# Altium project ws22_companion-1_0_0.PrjPcb (part 2 of 4)

## Sheet pmic_tps65263_buck.SchDoc
size A; SheetNumber: 7
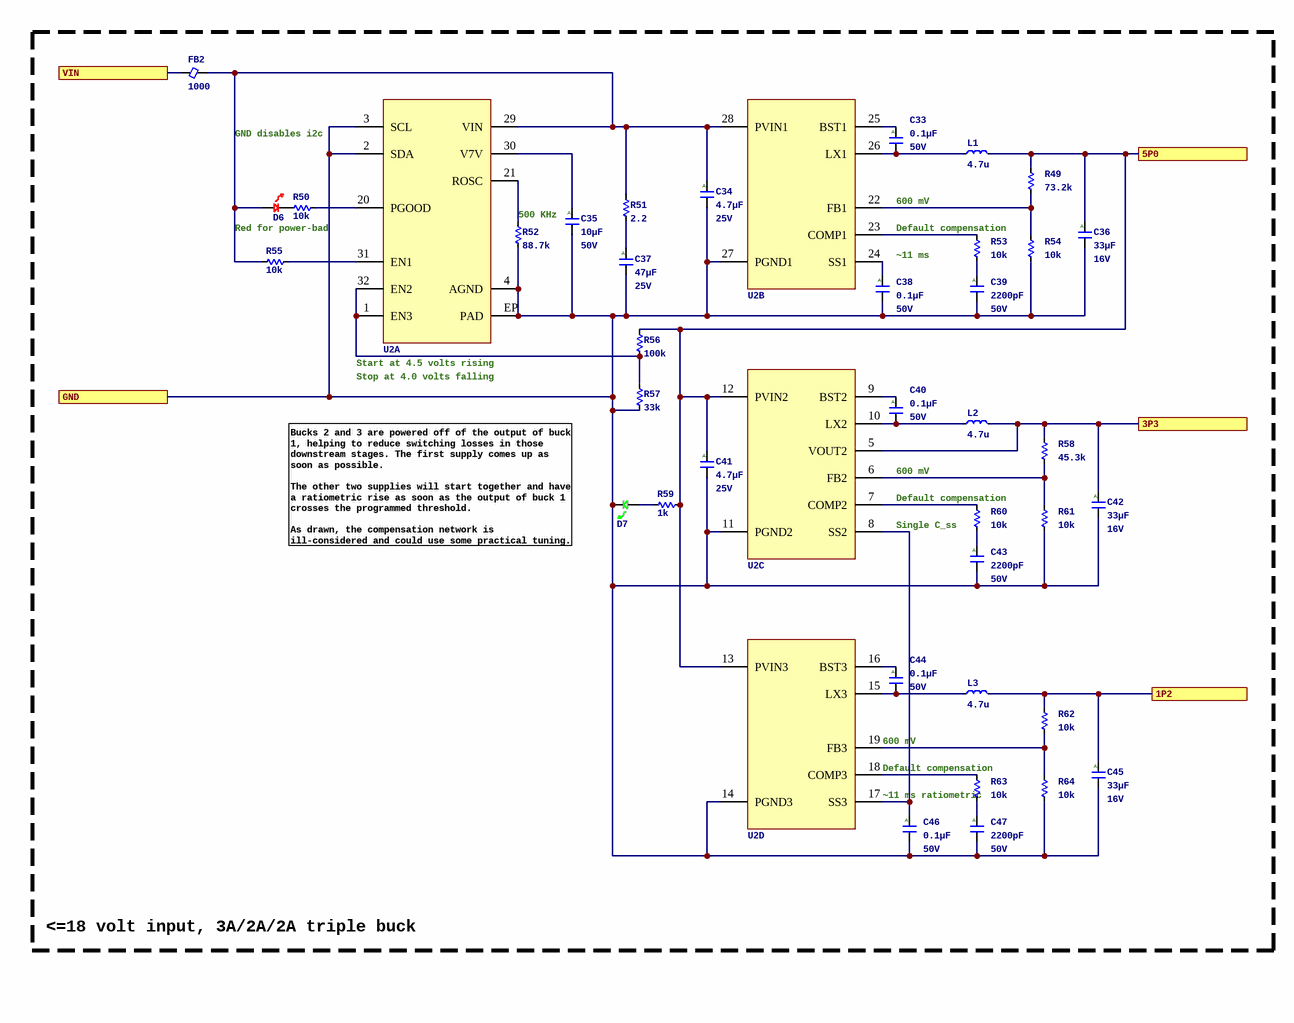
[diagram p6: pmic_tps65263_buck.SchDoc]

### Parts
C33  Capacitance: 0.1µF  Voltage - Rated: 50V  [C0402_0.55MM]  (hidden comment: CGA2B3X7R1H104M050BB)
C34  Capacitance: 4.7µF  Voltage - Rated: 25V  [C0805_1.45MM]  (hidden comment: CGA4J1X7R1E475K125AC)
C35  Capacitance: 10µF  Voltage - Rated: 50V  [C1206_1.90MM]  (hidden comment: CGA5L1X7R1H106K160AC)
C36  Capacitance: 33µF  Voltage - Rated: 16V  [C1812_2.50MM]  (hidden comment: CGA8P1X7R1C336M250KC)
C37  Capacitance: 47µF  Voltage - Rated: 25V  [C2220_2.50MM]  (hidden comment: CGA9N3X7R1E476M230KB)
C38  Capacitance: 0.1µF  Voltage - Rated: 50V  [C0402_0.55MM]  (hidden comment: CGA2B3X7R1H104M050BB)
C39  Capacitance: 2200pF  Voltage - Rated: 50V  [C0402_0.55MM]  (hidden comment: CGA2B2X7R1H222M050BA)
C40  Capacitance: 0.1µF  Voltage - Rated: 50V  [C0402_0.55MM]  (hidden comment: CGA2B3X7R1H104M050BB)
C41  Capacitance: 4.7µF  Voltage - Rated: 25V  [C0805_1.45MM]  (hidden comment: CGA4J1X7R1E475K125AC)
C42  Capacitance: 33µF  Voltage - Rated: 16V  [C1812_2.50MM]  (hidden comment: CGA8P1X7R1C336M250KC)
C43  Capacitance: 2200pF  Voltage - Rated: 50V  [C0402_0.55MM]  (hidden comment: CGA2B2X7R1H222M050BA)
C44  Capacitance: 0.1µF  Voltage - Rated: 50V  [C0402_0.55MM]  (hidden comment: CGA2B3X7R1H104M050BB)
C45  Capacitance: 33µF  Voltage - Rated: 16V  [C1812_2.50MM]  (hidden comment: CGA8P1X7R1C336M250KC)
C46  Capacitance: 0.1µF  Voltage - Rated: 50V  [C0402_0.55MM]  (hidden comment: CGA2B3X7R1H104M050BB)
C47  Capacitance: 2200pF  Voltage - Rated: 50V  [C0402_0.55MM]  (hidden comment: CGA2B2X7R1H222M050BA)
D6  LTST-C190KRKT  [LED_0603P_RED]  (value not drawn)
D7  LTST-C190GKT  [LED_0603P_GREEN]  (value not drawn)
FB2  Impedance (Ohms @ 100MHz): 1000  [FB0805_1.05MM]  (hidden comment: MPZ2012S102AT000)
L1  Inductance: 4.7u  [WE-MAPI_4030]  (hidden comment: 74438357047)
L2  Inductance: 4.7u  [WE-MAPI_4030]  (hidden comment: 74438357047)
L3  Inductance: 4.7u  [WE-MAPI_4030]  (hidden comment: 74438357047)
R49  Resistance: 73.2k  [R0402_0.40MM]  (hidden comment: ERJ-2RKF7322X)
R50  Resistance: 10k  [R0402_0.40MM]  (hidden comment: ERJ-2RKF1002X)
R51  Resistance: 2.2  [R0805_0.70MM]  (hidden comment: ERJ-6DQF2R2V)
R52  Resistance: 88.7k  [R0402_0.40MM]  (hidden comment: ERJ-2RKF8872X)
R53  Resistance: 10k  [R0402_0.40MM]  (hidden comment: ERJ-2RKF1002X)
R54  Resistance: 10k  [R0402_0.40MM]  (hidden comment: ERJ-2RKF1002X)
R55  Resistance: 10k  [R0402_0.40MM]  (hidden comment: ERJ-2RKF1002X)
R56  Resistance: 100k  [R0402_0.40MM]  (hidden comment: ERJ-2RKF1003X)
R57  Resistance: 33k  [R0402_0.40MM]  (hidden comment: ERJ-2RKF3302X)
R58  Resistance: 45.3k  [R0402_0.40MM]  (hidden comment: ERJ-2RKF4532X)
R59  Resistance: 1k  [R0402_0.40MM]
R60  Resistance: 10k  [R0402_0.40MM]  (hidden comment: ERJ-2RKF1002X)
R61  Resistance: 10k  [R0402_0.40MM]  (hidden comment: ERJ-2RKF1002X)
R62  Resistance: 10k  [R0402_0.40MM]  (hidden comment: ERJ-2RKF1002X)
R63  Resistance: 10k  [R0402_0.40MM]  (hidden comment: ERJ-2RKF1002X)
R64  Resistance: 10k  [R0402_0.40MM]  (hidden comment: ERJ-2RKF1002X)
U2  TPS65263QRHBRQ1  [TI_RHB]  (value not drawn)  (parts A,B,C,D of 4)

### Ports
1P2, 3P3, 5P0, GND, VIN

### Nets
1P2: C45.1 L3.2 R62.2 ; port 1P2
3P3: C42.1 L2.2 R58.2 U2.5(VOUT2) ; port 3P3
5P0: C36.1 C41.1 L1.2 R49.2 R56.2 R59.1 U2.12(PVIN2) U2.13(PVIN3) ; port 5P0
GND: C34.2 C35.2 C36.2 C37.2 C38.2 C39.2 C41.2 C42.2 C43.2 C45.2 C46.2 C47.2 D7.1 R52.1 R54.1 R57.1 R61.1 R64.1 U2.2(SDA) U2.3(SCL) U2.4(AGND) U2.11(PGND2) U2.14(PGND3) U2.27(PGND1) U2.EP(PAD) ; port GND
LV: FB2.1 ; port VIN
NetC33_1: C33.1 U2.25(BST1)
NetC33_2: C33.2 L1.1 U2.26(LX1)
NetC34_1: C34.1 D6.2 FB2.2 R51.2 R55.1 U2.28(PVIN1) U2.29(VIN)
NetC35_1: C35.1 U2.30(V7V)
NetC37_1: C37.1 R51.1
NetC38_1: C38.1 U2.24(SS1)
NetC39_1: C39.1 R53.1
NetC40_1: C40.1 U2.9(BST2)
NetC40_2: C40.2 L2.1 U2.10(LX2)
NetC43_1: C43.1 R60.1
NetC44_1: C44.1 U2.16(BST3)
NetC44_2: C44.2 L3.1 U2.15(LX3)
NetC46_1: C46.1 U2.8(SS2) U2.17(SS3)
NetC47_1: C47.1 R63.1
NetD6_1: D6.1 R50.2
NetD7_2: D7.2 R59.2
NetR49_1: R49.1 R54.2 U2.22(FB1)
NetR50_1: R50.1 U2.20(PGOOD)
NetR52_2: R52.2 U2.21(ROSC)
NetR53_2: R53.2 U2.23(COMP1)
NetR55_2: R55.2 U2.31(EN1)
NetR56_1: R56.1 R57.2 U2.1(EN3) U2.32(EN2)
NetR58_1: R58.1 R61.2 U2.6(FB2)
NetR60_2: R60.2 U2.7(COMP2)
NetR62_1: R62.1 R64.2 U2.19(FB3)
NetR63_2: R63.2 U2.18(COMP3)

### Notes on the sheet
- GND disables i2c
- Red for power-bad
- (near R52) 500 KHz
- 600 mV
- (near R53) Default compensation
- ~11 ms
- (near U2) Start at 4.5 volts rising
- Stop at 4.0 volts falling
- (near R60) Default compensation
- Bucks 2 and 3 are powered off of the output of buck 1, helping to reduce switching losses in those downstream stages. The first supply comes up as soon as possible.
  The other two supplies will start together and have a ratiometric rise as soon as the output of buck 1 crosses the programmed threshold.
  As drawn, the compensation network is ill-considered and could use some practical tuning.
- Single C_ss
- (near U2) 600 mV
- (near R63) Default compensation
- (near R63) ~11 ms ratiometric
- <=18 volt input, 3A/2A/2A triple buck
- (in symbol CGA2B2X7R1H222M050BA) A
- (in symbol CGA2B3X7R1H104M050BB) A
- (in symbol CGA4J1X7R1E475K125AC) A
- (in symbol CGA5L1X7R1H106K160AC) A
- (in symbol CGA8P1X7R1C336M250KC) A
- (in symbol CGA9N3X7R1E476M230KB) A

### Library data of the parts
C33 C38 C40 C44 C46 = CGA2B3X7R1H104M050BB: as C4 on sheet mcu_stm32f427; ComponentLink1URL: https://product.tdk.com/info/en/catalog/datasheets/mlcc_automotive_general_en.pdf?ref_disty=digikey; ComponentLink1Description: Series Datasheet; Series: CGA; Part Status: Active; Temperature Coefficient: X7R; Operating Temperature: -55°C ~ 125°C; Applications: AEC-Q200; Mounting Type: Surface Mount, MLCC; Package / Case: 0402 (1005 Metric); Size / Dimension: 0.039" L x 0.020" W (1.00mm x 0.50mm); Thickness (Max): 0.022" (0.55mm); Supplier 1: Digikey; Supplier Part Number 1: 445-12271-1-ND; Manufacturer Part Number: CGA2B3X7R1H104M050BB
C34 C41 = CGA4J1X7R1E475K125AC: CAP CER 4.7UF 25V X7R 0805; Manufacturer: TDK Corporation; Unit Price (USD): 0.56; Tolerance: ±10%; ComponentLink1URL: https://product.tdk.com/info/en/catalog/datasheets/mlcc_automotive_general_en.pdf?ref_disty=digikey; ComponentLink1Description: Series Datasheet; Series: CGA; Part Status: Active; Temperature Coefficient: X7R; Operating Temperature: -55°C ~ 125°C; Applications: AEC-Q200; Mounting Type: Surface Mount, MLCC; Package / Case: 0805 (2012 Metric); Size / Dimension: 0.079" L x 0.049" W (2.00mm x 1.25mm); Thickness (Max): 0.057" (1.45mm); Supplier 1: Digikey; Supplier Part Number 1: 445-6967-1-ND; Manufacturer Part Number: CGA4J1X7R1E475K125AC
C35 = CGA5L1X7R1H106K160AC: as C63 on sheet conn_usbc; ComponentLink1URL: https://product.tdk.com/info/en/catalog/datasheets/mlcc_automotive_general_en.pdf?ref_disty=digikey; ComponentLink1Description: Series Datasheet; Series: CGA; Part Status: Active; Temperature Coefficient: X7R; Operating Temperature: -55°C ~ 125°C; Applications: AEC-Q200; Mounting Type: Surface Mount, MLCC; Package / Case: 1206 (3216 Metric); Size / Dimension: 0.126" L x 0.063" W (3.20mm x 1.60mm); Thickness (Max): 0.075" (1.90mm); Supplier 1: Digikey; Supplier Part Number 1: 445-180362-1-ND; Manufacturer Part Number: CGA5L1X7R1H106K160AC
C36 C42 C45 = CGA8P1X7R1C336M250KC: CAP CER 33UF 16V X7R 1812; Manufacturer: TDK Corporation; Unit Price (USD): 1.67; Tolerance: ±20%; ComponentLink1URL: https://product.tdk.com/info/en/catalog/datasheets/mlcc_automotive_general_en.pdf?ref_disty=digikey; ComponentLink1Description: Series Datasheet; Series: CGA; Part Status: Active; Temperature Coefficient: X7R; Operating Temperature: -55°C ~ 125°C; Applications: AEC-Q200; Mounting Type: Surface Mount, MLCC; Package / Case: 1812 (4532 Metric); Size / Dimension: 0.177" L x 0.126" W (4.50mm x 3.20mm); Thickness (Max): 0.098" (2.50mm); Supplier 1: Digikey; Supplier Part Number 1: 445-7912-1-ND; Manufacturer Part Number: CGA8P1X7R1C336M250KC
C37 = CGA9N3X7R1E476M230KB: CAP CER 47UF 25V X7R 2220; Manufacturer: TDK Corporation; Unit Price (USD): 4.53; Tolerance: ±20%; ComponentLink1URL: https://product.tdk.com/info/en/catalog/datasheets/mlcc_automotive_general_en.pdf?ref_disty=digikey; ComponentLink1Description: Series Datasheet; Series: CGA; Part Status: Active; Temperature Coefficient: X7R; Operating Temperature: -55°C ~ 125°C; Applications: AEC-Q200; Mounting Type: Surface Mount, MLCC; Package / Case: 2220 (5750 Metric); Size / Dimension: 0.224" L x 0.197" W (5.70mm x 5.00mm); Thickness (Max): 0.098" (2.50mm); Supplier 1: Digikey; Supplier Part Number 1: 445-174773-1-ND; Manufacturer Part Number: CGA9N3X7R1E476M230KB
C39 C43 C47 = CGA2B2X7R1H222M050BA: CAP CER 2200PF 50V X7R 0402; Manufacturer: TDK Corporation; Unit Price (USD): 0.1; Tolerance: ±20%; ComponentLink1URL: https://product.tdk.com/info/en/catalog/datasheets/mlcc_automotive_general_en.pdf?ref_disty=digikey; ComponentLink1Description: Series Datasheet; Series: CGA; Part Status: Active; Temperature Coefficient: X7R; Operating Temperature: -55°C ~ 125°C; Applications: AEC-Q200; Mounting Type: Surface Mount, MLCC; Package / Case: 0402 (1005 Metric); Size / Dimension: 0.039" L x 0.020" W (1.00mm x 0.50mm); Thickness (Max): 0.022" (0.55mm); Supplier 1: Digikey; Supplier Part Number 1: 445-12274-1-ND; Manufacturer Part Number: CGA2B2X7R1H222M050BA
D6 = LED_0603_RED_LTST-C190KRKT: LED SUPER RED CLEAR 0603 SMD; Manufacturer: Lite-On Inc; ComponentLink1URL: https://optoelectronics.liteon.com/upload/download/DS-22-99-0151/LTST-C190KRKT.pdf; ComponentLink1Description: Datasheet; Supplier 1: Digikey; Supplier Part Number 1: 160-1436-1-ND; Manufacturer Part Number: LTST-C190KRKT; Supplier 2: LCSC; Supplier Part Number 2: C94869
D7 = LED_0603_GREEN_LTST-C190GKT: as D3 on sheet mcu_stm32f427; Supplier 1: Digikey; ComponentLink1URL: https://mm.digikey.com/Volume0/opasdata/d220001/medias/docus/858/LTST-C190GKT.pdf; ComponentLink1Description: Datasheet; Supplier Part Number 1: 160-1183-1-ND; Manufacturer Part Number: LTST-C190GKT; Supplier 2: LCSC; Supplier Part Number 2: C125093
FB2 = MPZ2012S102AT000: FERRITE BEAD 1 KOHM 0805 1LN; Manufacturer: TDK Corporation; Filter Type: Power Line; Current Rating (Max): 1.5A; DC Resistance (DCR) (Max): 150mOhm; ComponentLink1URL: https://product.tdk.com/info/en/catalog/datasheets/beads_commercial_power_mpz2012_en.pdf?ref_disty=digikey; ComponentLink1Description: Datasheet; Series: MPZ; Part Status: Active; Operating Temperature: -55°C ~ 125°C; Package / Case: 0805 (2012 Metric); Mounting Type: Surface Mount; Height (Max): 0.041" (1.05mm); Size / Dimension: 0.079" L x 0.049" W (2.00mm x 1.25mm); Supplier Part Number 1: 445-5223-1-ND; Supplier 1: Digikey; Manufacturer Part Number: MPZ2012S102AT000
L1-L3 = 74438357047: FIXED IND 4.7UH 3.9A 44 MOHM SMD; Manufacturer: Würth Elektronik; Type: Molded; Material - Core: Metal Composite; Tolerance: ±20%; Current - Saturation: 6.4A; Shielding: Shielded; DC Resistance (DCR): 44mOhm Max; Frequency - Self Resonant: 24MHz; Inductance Frequency - Test: 100kHz; ComponentLink1URL: https://katalog.we-online.de/pbs/datasheet/74438357047.pdf; ComponentLink1Description: Datasheet; Supplier 1: Digikey; Supplier Part Number 1: 732-11202-1-ND; Series: WE-MAPI; Part Status: Active; Current Rating (Amps): 3.9A; Q @ Freq: -; Operating Temperature: -40°C ~ 125°C; Mounting Type: Surface Mount; Package / Case: Nonstandard; Supplier Device Package: 4030; Size / Dimension: 0.161" L x 0.161" W (4.10mm x 4.10mm); Height - Seated (Max): 0.122" (3.10mm); Manufacturer Part Number: 74438357047
R49 = ERJ-2RKF7322X: RES SMD 73.2K OHM 1% 1/10W 0402; Manufacturer: Panasonic Electronic Components; Unit Price (USD): 0.1; Power (Watts): 0.1W, 1/10W; Temperature Coefficient: ±100ppm/°C; ComponentLink1Description: Datasheet; ComponentLink1URL: https://industrial.panasonic.com/cdbs/www-data/pdf/RDA0000/AOA0000C304.pdf; Series: ERJ; Tolerance: ±1%; Composition: Thick Film; Features: Automotive AEC-Q200; Operating Temperature: -55°C ~ 155°C; Package / Case: 0402 (1005 Metric); Supplier Device Package: 0402; Size / Dimension: 0.039" L x 0.020" W (1.00mm x 0.50mm); Height - Seated (Max): 0.016" (0.40mm); Supplier 1: Digikey; Supplier Part Number 1: P73.2KLCT-ND; Manufacturer Part Number: ERJ-2RKF7322X
R50 R53-R55 R60-R64 = ERJ-2RKF1002X: RES SMD 10K OHM 1% 1/10W 0402; Manufacturer: Panasonic Electronic Components; Unit Price (USD): 0.1; Power (Watts): 0.1W, 1/10W; Temperature Coefficient: ±100ppm/°C; ComponentLink1Description: Datasheet; ComponentLink1URL: https://industrial.panasonic.com/cdbs/www-data/pdf/RDA0000/AOA0000C304.pdf; Series: ERJ; Tolerance: ±1%; Composition: Thick Film; Features: Automotive AEC-Q200; Operating Temperature: -55°C ~ 155°C; Package / Case: 0402 (1005 Metric); Supplier Device Package: 0402; Size / Dimension: 0.039" L x 0.020" W (1.00mm x 0.50mm); Height - Seated (Max): 0.016" (0.40mm); Supplier 1: Digikey; Supplier Part Number 1: P10.0KLCT-ND; Manufacturer Part Number: ERJ-2RKF1002X
R51 = ERJ-6DQF2R2V: RES SMD 2.2 OHM 1% 1/2W 0805; Manufacturer: Panasonic Electronic Components; Unit Price (USD): 0.36; Power (Watts): 0.5W, 1/2W; Temperature Coefficient: ±100ppm/°C; ComponentLink1Description: Datasheet; ComponentLink1URL: https://industrial.panasonic.com/cdbs/www-data/pdf/RDN0000/AOA0000C313.pdf; Series: ERJ; Tolerance: ±1%; Composition: Thick Film; Features: Automotive AEC-Q200, Current Sense; Operating Temperature: -55°C ~ 155°C; Package / Case: 0805 (2012 Metric); Supplier Device Package: 0805; Size / Dimension: 0.079" L x 0.049" W (2.00mm x 1.25mm); Height - Seated (Max): 0.028" (0.70mm); Supplier 1: Digikey; Supplier Part Number 1: P19276CT-ND; Manufacturer Part Number: ERJ-6DQF2R2V
R52 = ERJ-2RKF8872X: RES SMD 88.7K OHM 1% 1/10W 0402; Manufacturer: Panasonic Electronic Components; Unit Price (USD): 0.1; Power (Watts): 0.1W, 1/10W; Temperature Coefficient: ±100ppm/°C; ComponentLink1Description: Datasheet; ComponentLink1URL: https://industrial.panasonic.com/cdbs/www-data/pdf/RDA0000/AOA0000C304.pdf; Series: ERJ; Tolerance: ±1%; Composition: Thick Film; Features: Automotive AEC-Q200; Operating Temperature: -55°C ~ 155°C; Package / Case: 0402 (1005 Metric); Supplier Device Package: 0402; Size / Dimension: 0.039" L x 0.020" W (1.00mm x 0.50mm); Height - Seated (Max): 0.016" (0.40mm); Supplier 1: Digikey; Supplier Part Number 1: P88.7KLCT-ND; Manufacturer Part Number: ERJ-2RKF8872X
R56 = ERJ-2RKF1003X: RES SMD 100K OHM 1% 1/10W 0402; Manufacturer: Panasonic Electronic Components; Unit Price (USD): 0.1; Power (Watts): 0.1W, 1/10W; Temperature Coefficient: ±100ppm/°C; ComponentLink1Description: Datasheet; ComponentLink1URL: https://industrial.panasonic.com/cdbs/www-data/pdf/RDA0000/AOA0000C304.pdf; Series: ERJ; Tolerance: ±1%; Composition: Thick Film; Features: Automotive AEC-Q200; Operating Temperature: -55°C ~ 155°C; Package / Case: 0402 (1005 Metric); Supplier Device Package: 0402; Size / Dimension: 0.039" L x 0.020" W (1.00mm x 0.50mm); Height - Seated (Max): 0.016" (0.40mm); Supplier 1: Digikey; Supplier Part Number 1: P100KLCT-ND; Manufacturer Part Number: ERJ-2RKF1003X
R57 = ERJ-2RKF3302X: RES SMD 33K OHM 1% 1/10W 0402; Manufacturer: Panasonic Electronic Components; Unit Price (USD): 0.1; Power (Watts): 0.1W, 1/10W; Temperature Coefficient: ±100ppm/°C; ComponentLink1Description: Datasheet; ComponentLink1URL: https://industrial.panasonic.com/cdbs/www-data/pdf/RDA0000/AOA0000C304.pdf; Series: ERJ; Tolerance: ±1%; Composition: Thick Film; Features: Automotive AEC-Q200; Operating Temperature: -55°C ~ 155°C; Package / Case: 0402 (1005 Metric); Supplier Device Package: 0402; Size / Dimension: 0.039" L x 0.020" W (1.00mm x 0.50mm); Height - Seated (Max): 0.016" (0.40mm); Supplier 1: Digikey; Supplier Part Number 1: P33.0KLCT-ND; Manufacturer Part Number: ERJ-2RKF3302X
R58 = ERJ-2RKF4532X: RES SMD 45.3K OHM 1% 1/10W 0402; Manufacturer: Panasonic Electronic Components; Unit Price (USD): 0.1; Power (Watts): 0.1W, 1/10W; Temperature Coefficient: ±100ppm/°C; ComponentLink1Description: Datasheet; ComponentLink1URL: https://industrial.panasonic.com/cdbs/www-data/pdf/RDA0000/AOA0000C304.pdf; Series: ERJ; Tolerance: ±1%; Composition: Thick Film; Features: Automotive AEC-Q200; Operating Temperature: -55°C ~ 155°C; Package / Case: 0402 (1005 Metric); Supplier Device Package: 0402; Size / Dimension: 0.039" L x 0.020" W (1.00mm x 0.50mm); Height - Seated (Max): 0.016" (0.40mm); Supplier 1: Digikey; Supplier Part Number 1: P45.3KLCT-ND; Manufacturer Part Number: ERJ-2RKF4532X
R59 = ERJ-2RKF1001X: as R4 on sheet mcu_stm32f427; ComponentLink1Description: Datasheet; ComponentLink1URL: https://industrial.panasonic.com/cdbs/www-data/pdf/RDA0000/AOA0000C304.pdf; Series: ERJ; Tolerance: ±1%; Composition: Thick Film; Features: Automotive AEC-Q200; Operating Temperature: -55°C ~ 155°C; Package / Case: 0402 (1005 Metric); Supplier Device Package: 0402; Size / Dimension: 0.039" L x 0.020" W (1.00mm x 0.50mm); Height - Seated (Max): 0.016" (0.40mm); Manufacturer Part Number 1: ERJ-2RKF1001X; Supplier 1: Digikey; Supplier Part Number 1: P1.00KLCT-ND
U2 = BUCK_TPS65263QRHBRQ1: Switching Regulator, Current-mode, 3A, 2300kHz Switching Freq-Max, PQCC32; Manufacturer: Texas Instruments; ComponentLink4URL: https://www.ti.com/lit/ds/symlink/tps65263-q1.pdf; ComponentLink4Description: Datasheet; Supplier 1: Digikey; Supplier Part Number 1: 296-40886-1-ND; Supplier 2: LCSC; Supplier Part Number 2: C2073290; Manufacturer Part Number: TPS65263QRHBRQ1

## Sheet fan_interface.SchDoc
size A; SheetNumber: 11
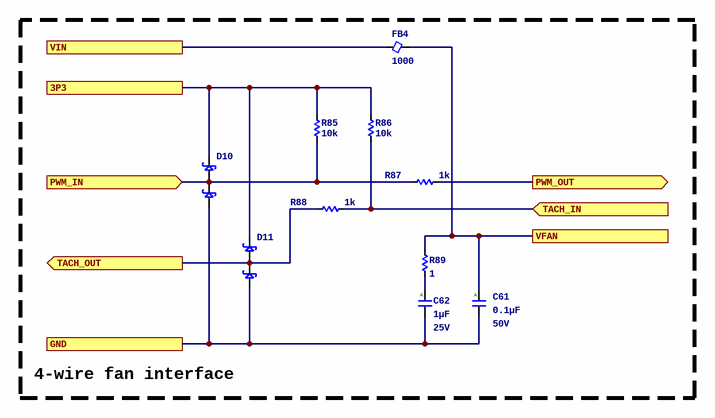
[diagram p7: fan_interface.SchDoc]

### Parts
C61  Capacitance: 0.1µF  Voltage - Rated: 50V  [C0402_0.55MM]  (hidden comment: CGA2B3X7R1H104M050BB)
C62  Capacitance: 1µF  Voltage - Rated: 25V  [C0603_0.80MM]  (hidden comment: CGJ3E1X7R1E105K080AC)
D10  BAT54SLT1G  [3SOT23]  (value not drawn)
D11  BAT54SLT1G  [3SOT23]  (value not drawn)
FB4  Impedance (Ohms @ 100MHz): 1000  [FB0805_1.05MM]  (hidden comment: MPZ2012S102AT000)
R85  Resistance: 10k  [R0402_0.40MM]
R86  Resistance: 10k  [R0402_0.40MM]
R87  Resistance: 1k  [R0402_0.40MM]
R88  Resistance: 1k  [R0402_0.40MM]
R89  Resistance: 1  [R0402_0.40MM]  (hidden comment: ERJ-2BQF1R0X)

### Blocks framed on the sheet
4-wire fan interface: C61 C62 D10 D11 FB4 R85-R89

### Ports
3P3, GND, PWM_IN (in), PWM_OUT (out), TACH_IN (in), TACH_OUT (out), VFAN, VIN

### Nets
3P3: D10.2 D11.2 R85.1 R86.1 ; port 3P3
GND: C61.2 C62.2 D10.1 D11.1 ; port GND
LV: FB4.1 ; port VIN
FAN0_POWER: C61.1 FB4.2 R89.2 ; port VFAN
FAN0_PWM: R87.1 ; port PWM_OUT
FAN0_TACH: R86.2 R88.1 ; port TACH_IN
MCU_FAN0_PWM: D10.3 R85.2 R87.2 ; port PWM_IN
MCU_FAN0_TACH: D11.3 R88.2 ; port TACH_OUT
NetC62_1: C62.1 R89.1

### Notes on the sheet
- (in symbol CGA2B3X7R1H104M050BB) A
- (in symbol CGJ3E1X7R1E105K080AC) A

### Library data of the parts
C61 = CGA2B3X7R1H104M050BB: as C4 on sheet mcu_stm32f427; ComponentLink1URL: https://product.tdk.com/info/en/catalog/datasheets/mlcc_automotive_general_en.pdf?ref_disty=digikey; ComponentLink1Description: Series Datasheet; Series: CGA; Part Status: Active; Temperature Coefficient: X7R; Operating Temperature: -55°C ~ 125°C; Applications: AEC-Q200; Mounting Type: Surface Mount, MLCC; Package / Case: 0402 (1005 Metric); Size / Dimension: 0.039" L x 0.020" W (1.00mm x 0.50mm); Thickness (Max): 0.022" (0.55mm); Supplier 1: Digikey; Supplier Part Number 1: 445-12271-1-ND; Manufacturer Part Number: CGA2B3X7R1H104M050BB
C62 = CGJ3E1X7R1E105K080AC: as C12 on sheet mcu_stm32f427; ComponentLink1URL: https://product.tdk.com/info/en/catalog/datasheets/mlcc_highreliability_general_en.pdf?ref_disty=digikey; ComponentLink1Description: Series Datasheet; Series: CGJ; Part Status: Active; Temperature Coefficient: X7R; Operating Temperature: -55°C ~ 125°C; Applications: AEC-Q200; Mounting Type: Surface Mount, MLCC; Package / Case: 0603 (1608 Metric); Size / Dimension: 0.063" L x 0.031" W (1.60mm x 0.80mm); Thickness (Max): 0.031" (0.80mm); Supplier 1: Digikey; Supplier Part Number 1: 445-13311-1-ND; Manufacturer Part Number: CGJ3E1X7R1E105K080AC
D10 D11 = SCHOTTKY_30V_DUAL_BAT54SLT1G: DIODE SCHOTTKY DUAL 30V SOT23; Manufacturer: ON Semiconductor; Supplier 1: Digikey; Manufacturer Part Number: BAT54SLT1G; RoHS: RoHS Compliant; ComponentLink1URL: https://www.onsemi.com/pdf/datasheet/bat54slt1-d.pdf; ComponentLink1Description: Datasheet; Supplier Part Number 1: BAT54SLT1GOSCT-ND; Supplier 2: LCSC; Supplier Part Number 2: C19726
FB4 = MPZ2012S102AT000: as FB2 on sheet pmic_tps65263_buck; ComponentLink1URL: https://product.tdk.com/info/en/catalog/datasheets/beads_commercial_power_mpz2012_en.pdf?ref_disty=digikey; ComponentLink1Description: Datasheet; Series: MPZ; Part Status: Active; Operating Temperature: -55°C ~ 125°C; Package / Case: 0805 (2012 Metric); Mounting Type: Surface Mount; Height (Max): 0.041" (1.05mm); Size / Dimension: 0.079" L x 0.049" W (2.00mm x 1.25mm); Supplier Part Number 1: 445-5223-1-ND; Supplier 1: Digikey; Manufacturer Part Number: MPZ2012S102AT000
R85 R86 = ERJ-2RKF1002X: as R19 on sheet mcu_stm32f427; ComponentLink1Description: Datasheet; ComponentLink1URL: https://industrial.panasonic.com/cdbs/www-data/pdf/RDA0000/AOA0000C304.pdf; Series: ERJ; Tolerance: ±1%; Composition: Thick Film; Features: Automotive AEC-Q200; Operating Temperature: -55°C ~ 155°C; Package / Case: 0402 (1005 Metric); Supplier Device Package: 0402; Size / Dimension: 0.039" L x 0.020" W (1.00mm x 0.50mm); Height - Seated (Max): 0.016" (0.40mm); Manufacturer Part Number 1: ERJ-2RKF1002X; Supplier 1: Digikey; Supplier Part Number 1: P10.0KLCT-ND
R87 R88 = ERJ-2RKF1001X: as R4 on sheet mcu_stm32f427; ComponentLink1Description: Datasheet; ComponentLink1URL: https://industrial.panasonic.com/cdbs/www-data/pdf/RDA0000/AOA0000C304.pdf; Series: ERJ; Tolerance: ±1%; Composition: Thick Film; Features: Automotive AEC-Q200; Operating Temperature: -55°C ~ 155°C; Package / Case: 0402 (1005 Metric); Supplier Device Package: 0402; Size / Dimension: 0.039" L x 0.020" W (1.00mm x 0.50mm); Height - Seated (Max): 0.016" (0.40mm); Manufacturer Part Number 1: ERJ-2RKF1001X; Supplier 1: Digikey; Supplier Part Number 1: P1.00KLCT-ND
R89 = ERJ-2BQF1R0X: as R5 on sheet mcu_stm32f427; ComponentLink1Description: Datasheet; ComponentLink1URL: https://industrial.panasonic.com/cdbs/www-data/pdf/RDN0000/AOA0000C313.pdf; Series: ERJ; Tolerance: ±1%; Composition: Thick Film; Features: Automotive AEC-Q200, Current Sense; Operating Temperature: -55°C ~ 125°C; Package / Case: 0402 (1005 Metric); Supplier Device Package: 0402; Size / Dimension: 0.039" L x 0.020" W (1.00mm x 0.50mm); Height - Seated (Max): 0.016" (0.40mm); Supplier 1: Digikey; Supplier Part Number 1: P17252CT-ND; Manufacturer Part Number: ERJ-2BQF1R0X

## Sheet can_tcan1462v.SchDoc
size A; SheetNumber: 10
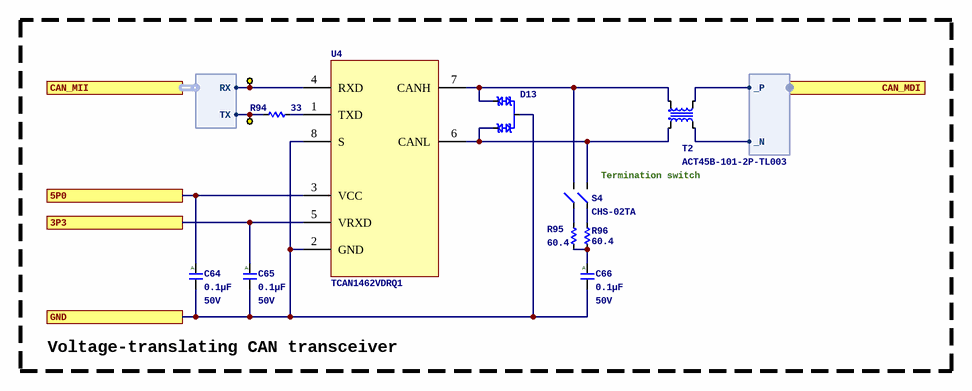
[diagram p8: can_tcan1462v.SchDoc]

### Parts
C64  Capacitance: 0.1µF  Voltage - Rated: 50V  [C0402_0.55MM]  (hidden comment: CGA2B3X7R1H104M050BB)
C65  Capacitance: 0.1µF  Voltage - Rated: 50V  [C0402_0.55MM]  (hidden comment: CGA2B3X7R1H104M050BB)
C66  Capacitance: 0.1µF  Voltage - Rated: 50V  [C0402_0.55MM]  (hidden comment: CGA2B3X7R1H104M050BB)
D13  PESD2CAN,215  [3SOT23]  (value not drawn)
R94  Resistance: 33  [R0402_0.40MM]  (hidden comment: ERJ-2RKF33R0X)
R95  Resistance: 60.4  [R0402_0.40MM]  (hidden comment: ERJ-2RKF60R4X)
R96  Resistance: 60.4  [R0402_0.40MM]  (hidden comment: ERJ-2RKF60R4X)
S4  CHS-02TA  [SWITCH_NIDEC_CHS-02TA]
T2  Manufacturer Part Number: ACT45B-101-2P-TL003  [CHOKE_ACT45B-101-2P-TL003]  (hidden comment: CHOKE_ACT45B-101-2P-TL003)
TP3  (no value)  [TP_GRABBY]  (no BOM)
TP4  (no value)  [TP_GRABBY]  (no BOM)
U4  TCAN1462VDRQ1  [8SOIC150]

### Ports
3P3, 5P0, CAN_MDI (harness DIFF), CAN_MII (harness CAN), GND

### Harnesses
CAN: TX, RX
DIFF: _P, _N

### Nets
3P3: C65.1 U4.5(VRXD) ; port 3P3
5P0: C64.1 U4.3(VCC) ; port 5P0
GND: C64.2 C65.2 C66.2 D13.3 U4.2(GND) U4.8(S) ; port GND
CAN1_MDI._N: T2.4 ; port CAN_MDI._N
CAN1_MDI._P: T2.3 ; port CAN_MDI._P
CAN2.RX: TP3.1 U4.4(RXD) ; port CAN_MII.RX
CAN2.TX: R94.1 TP4.1 ; port CAN_MII.TX
NetC66_1: C66.1 R95.2 R96.1
NetD13_1: D13.1 S4.2 T2.2 U4.7(CANH)
NetD13_2: D13.2 S4.4 T2.1 U4.6(CANL)
NetR94_2: R94.2 U4.1(TXD)
NetR95_1: R95.1 S4.1
NetR96_2: R96.2 S4.3

### Notes on the sheet
- (near S4) Termination switch
- Voltage-translating CAN transceiver
- (in symbol CGA2B3X7R1H104M050BB) A

### Library data of the parts
C64-C66 = CGA2B3X7R1H104M050BB: as C4 on sheet mcu_stm32f427; ComponentLink1URL: https://product.tdk.com/info/en/catalog/datasheets/mlcc_automotive_general_en.pdf?ref_disty=digikey; ComponentLink1Description: Series Datasheet; Series: CGA; Part Status: Active; Temperature Coefficient: X7R; Operating Temperature: -55°C ~ 125°C; Applications: AEC-Q200; Mounting Type: Surface Mount, MLCC; Package / Case: 0402 (1005 Metric); Size / Dimension: 0.039" L x 0.020" W (1.00mm x 0.50mm); Thickness (Max): 0.022" (0.55mm); Supplier 1: Digikey; Supplier Part Number 1: 445-12271-1-ND; Manufacturer Part Number: CGA2B3X7R1H104M050BB
D13 = TVS_PESD2CAN: DIODE ESD CAN SOT-23; Manufacturer: NXP Semiconductors; Supplier 1: Digikey; ComponentLink1URL: https://assets.nexperia.com/documents/data-sheet/PESD2CAN.pdf; ComponentLink1Description: Datasheet; Supplier Part Number 1: 1727-3891-1-ND; Manufacturer Part Number: PESD2CAN,215; Supplier 2: LCSC; Supplier Part Number 2: C75176
R94 = ERJ-2RKF33R0X: as R1 on sheet mcu_stm32f427; ComponentLink1Description: Datasheet; ComponentLink1URL: https://industrial.panasonic.com/cdbs/www-data/pdf/RDA0000/AOA0000C304.pdf; Series: ERJ; Tolerance: ±1%; Composition: Thick Film; Features: Automotive AEC-Q200; Operating Temperature: -55°C ~ 155°C; Package / Case: 0402 (1005 Metric); Supplier Device Package: 0402; Size / Dimension: 0.039" L x 0.020" W (1.00mm x 0.50mm); Height - Seated (Max): 0.016" (0.40mm); Supplier 1: Digikey; Supplier Part Number 1: P33.0LCT-ND; Manufacturer Part Number: ERJ-2RKF33R0X
R95 R96 = ERJ-2RKF60R4X: RES SMD 60.4 OHM 1% 1/10W 0402; Manufacturer: Panasonic Electronic Components; Unit Price (USD): 0.1; Power (Watts): 0.1W, 1/10W; Temperature Coefficient: ±100ppm/°C; ComponentLink1Description: Datasheet; ComponentLink1URL: https://industrial.panasonic.com/cdbs/www-data/pdf/RDA0000/AOA0000C304.pdf; Series: ERJ; Tolerance: ±1%; Composition: Thick Film; Features: Automotive AEC-Q200; Operating Temperature: -55°C ~ 155°C; Package / Case: 0402 (1005 Metric); Supplier Device Package: 0402; Size / Dimension: 0.039" L x 0.020" W (1.00mm x 0.50mm); Height - Seated (Max): 0.016" (0.40mm); Supplier 1: Digikey; Supplier Part Number 1: P60.4LCT-ND; Manufacturer Part Number: ERJ-2RKF60R4X
S4 = SWITCH_CHS-02TA: DIP Switch, Slide, SPST, Flush, Recessed, 6VDC, 100mA, CHS Series | Nidec Components CHS-02TA; Manufacturer: Nidec Copal; Supplier 1: Digikey; Supplier Part Number 1: 563-1005-1-ND; Manufacturer Part Number: CHS-02TA; Supplier 2: LCSC; Supplier Part Number 2: C2921606; ComponentLink1Description: Datasheet; ComponentLink1URL: https://www.nidec-components.com/e/catalog/switch/chs.pdf
T2 = CHOKE_ACT45B-101-2P-TL003: CHOKE COMMON MODE 5000 OHM SMD; Manufacturer: TDK Corporation; Supplier 1: Digikey; Size / Dimension: 0.177" L x 0.126" W (4.50mm x 3.20mm); ComponentLink1URL: http://www.tdk.co.jp/tefe02/e9711_act.pdf; ComponentLink1Description: Datasheet; Supplier Part Number 1: 445-3959-1-ND; Supplier 2: LCSC; Supplier Part Number 2: C88056
TP3 TP4 = TEST_GRABBER: as TP8 on sheet top
U4 = CAN_TCAN1462VDRQ1: Automotive signal improvement CAN FD transceiver with VIO and standby 8-SOIC -40 to 125; Manufacturer: Texas Instruments; Supplier 1: Digikey; Supplier Part Number 1: 296-TCAN1462VDRQ1CT-ND; Manufacturer Part Number: TCAN1462VDRQ1; ComponentLink1Description: Datasheet; ComponentLink1URL: https://www.ti.com/lit/ds/symlink/tcan1462-q1.pdf; Supplier 2: LCSC; Supplier Part Number 2: C7399456